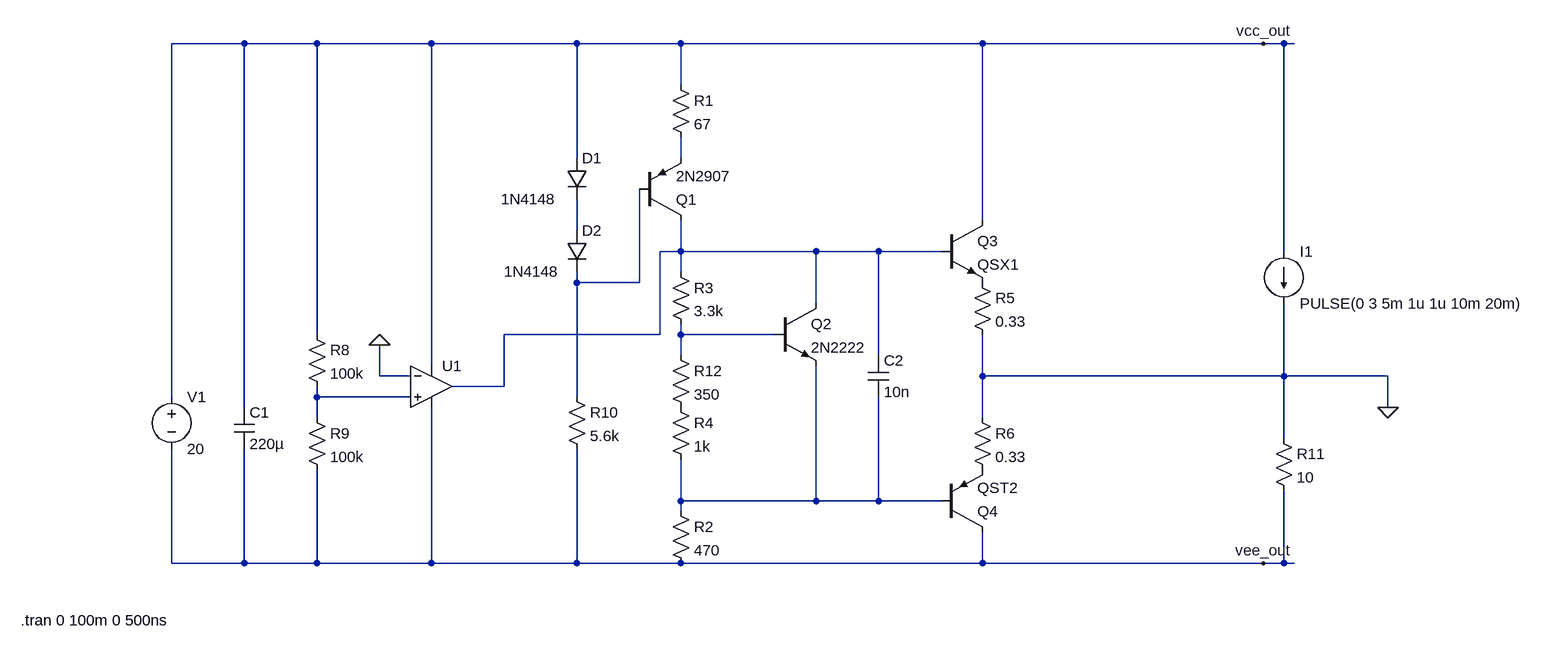
[diagram p0: schematic classAB_Vbe.asc]
classAB_Vbe.asc, the LTspice schematic file:
Version 4
SHEET 1 1304 728
WIRE -688 -224 -800 -224
WIRE -576 -224 -688 -224
WIRE -400 -224 -576 -224
WIRE -176 -224 -400 -224
WIRE -16 -224 -176 -224
WIRE 448 -224 -16 -224
WIRE 880 -224 448 -224
WIRE 912 -224 880 -224
WIRE 928 -224 912 -224
WIRE -16 -160 -16 -224
WIRE -176 -48 -176 -224
WIRE -16 -48 -16 -80
WIRE 448 48 448 -224
WIRE -176 64 -176 16
WIRE -16 96 -16 48
WIRE -16 96 -48 96
WIRE 192 96 -16 96
WIRE 288 96 192 96
WIRE 384 96 288 96
WIRE 912 96 912 -224
WIRE -16 128 -16 96
WIRE -176 144 -176 128
WIRE -80 144 -80 0
WIRE -80 144 -176 144
WIRE 192 176 192 96
WIRE -576 224 -576 -224
WIRE -48 224 -48 96
WIRE -48 224 -288 224
WIRE -16 224 -16 208
WIRE 128 224 -16 224
WIRE -16 256 -16 224
WIRE 288 256 288 96
WIRE -400 272 -400 -224
WIRE -480 288 -480 240
WIRE -432 288 -480 288
WIRE 448 288 448 224
WIRE 912 288 912 176
WIRE 912 288 448 288
WIRE 1072 288 912 288
WIRE -288 304 -288 224
WIRE -288 304 -368 304
WIRE -800 320 -800 -224
WIRE -576 320 -576 304
WIRE -432 320 -576 320
WIRE -176 320 -176 144
WIRE -688 336 -688 -224
WIRE 1072 336 1072 288
WIRE -576 352 -576 320
WIRE 448 352 448 288
WIRE 912 384 912 288
WIRE -16 480 -16 416
WIRE 192 480 192 272
WIRE 192 480 -16 480
WIRE 288 480 288 320
WIRE 288 480 192 480
WIRE 384 480 288 480
WIRE -16 496 -16 480
WIRE -800 576 -800 400
WIRE -688 576 -688 400
WIRE -688 576 -800 576
WIRE -576 576 -576 432
WIRE -576 576 -688 576
WIRE -400 576 -400 336
WIRE -400 576 -576 576
WIRE -176 576 -176 400
WIRE -176 576 -400 576
WIRE -16 576 -176 576
WIRE 448 576 448 528
WIRE 448 576 -16 576
WIRE 880 576 448 576
WIRE 912 576 912 464
WIRE 912 576 880 576
WIRE 928 576 912 576
FLAG -480 240 0
FLAG 880 -224 vcc_out
FLAG 880 576 vee_out
FLAG 1072 336 0
SYMBOL res 432 128 R0
SYMATTR InstName R5
SYMATTR Value 0.33
SYMBOL res 432 336 R0
SYMATTR InstName R6
SYMATTR Value 0.33
SYMBOL OpAmps\\UniversalOpAmp2 -400 304 R0
SYMATTR InstName U1
SYMBOL res -592 208 R0
SYMATTR InstName R8
SYMATTR Value 100k
SYMBOL res -592 336 R0
SYMATTR InstName R9
SYMATTR Value 100k
SYMBOL voltage -800 304 R0
WINDOW 123 0 0 Left 0
WINDOW 39 0 0 Left 0
SYMATTR InstName V1
SYMATTR Value 20
SYMBOL cap -704 336 R0
SYMATTR InstName C1
SYMATTR Value 220µ
SYMBOL res 896 368 R0
SYMATTR InstName R11
SYMATTR Value 10
SYMBOL cap 272 256 R0
SYMATTR InstName C2
SYMATTR Value 10n
SYMBOL npn 128 176 R0
SYMATTR InstName Q2
SYMATTR Value 2N2222
SYMBOL res -32 112 R0
SYMATTR InstName R3
SYMATTR Value 3.3k
SYMBOL res -32 320 R0
SYMATTR InstName R4
SYMATTR Value 1k
SYMBOL res -32 480 R0
SYMATTR InstName R2
SYMATTR Value 470
SYMBOL current 912 96 R0
WINDOW 123 0 0 Left 0
WINDOW 39 0 0 Left 0
SYMATTR InstName I1
SYMATTR Value PULSE(0 3 5m 1u 1u 10m 20m)
SYMBOL pnp -80 48 M180
SYMATTR InstName Q1
SYMATTR Value 2N2907
SYMBOL res -32 -176 R0
SYMATTR InstName R1
SYMATTR Value 67
SYMBOL res -192 304 R0
SYMATTR InstName R10
SYMATTR Value 5.6k
SYMBOL diode -192 -48 R0
WINDOW 3 -101 63 Left 2
SYMATTR Value 1N4148
SYMATTR InstName D1
SYMBOL diode -192 64 R0
WINDOW 3 -96 63 Left 2
SYMATTR Value 1N4148
SYMATTR InstName D2
SYMBOL res -32 240 R0
SYMATTR InstName R12
SYMATTR Value 350
SYMBOL npn 384 48 R0
SYMATTR InstName Q3
SYMATTR Value QSX1
SYMBOL pnp 384 528 M180
SYMATTR InstName Q4
SYMATTR Value QST2
TEXT -1032 664 Left 2 !.tran 0 100m 0 500ns

The netlist it stands for:
* classAB_Vbe.asc
R5 P001 0 0.33
R6 0 P002 0.33
XU1 N006 0 vcc_out vee_out N003 level2 Avol=1Meg GBW=10Meg Slew=10Meg Ilimit=25m Rail=0 Vos=0 En=0 Enk=0 In=0 Ink=0 Rin=500Meg  ; pins In+ In- V+ V- OUT
R8 vcc_out N006 100k
R9 N006 vee_out 100k
V1 vcc_out vee_out 20
C1 vcc_out vee_out 220µ
R11 0 vee_out 10
C2 N003 N007 10n
Q2 N003 N005 N007 0 2N2222
R3 N003 N005 3.3k
R4 P003 N007 1k
R2 N007 vee_out 470
I1 vcc_out 0 PULSE(0 3 5m 1u 1u 10m 20m)
Q1 N003 N004 N001 0 2N2907
R1 vcc_out N001 67
R10 N004 vee_out 5.6k
D1 vcc_out N002 1N4148
D2 N002 N004 1N4148
R12 N005 P003 350
Q3 vcc_out N003 P001 0 QSX1
Q4 vee_out N007 P002 0 QST2
.model D D
.lib standard.dio
.model NPN NPN
.model PNP PNP
.lib standard.bjt
.tran 0 100m 0 500ns
.lib UniversalOpAmp2.lib
.backanno
.end